# EAGLE design gotoDUO emonDC v0.3a (EAGLE 7.7.0)
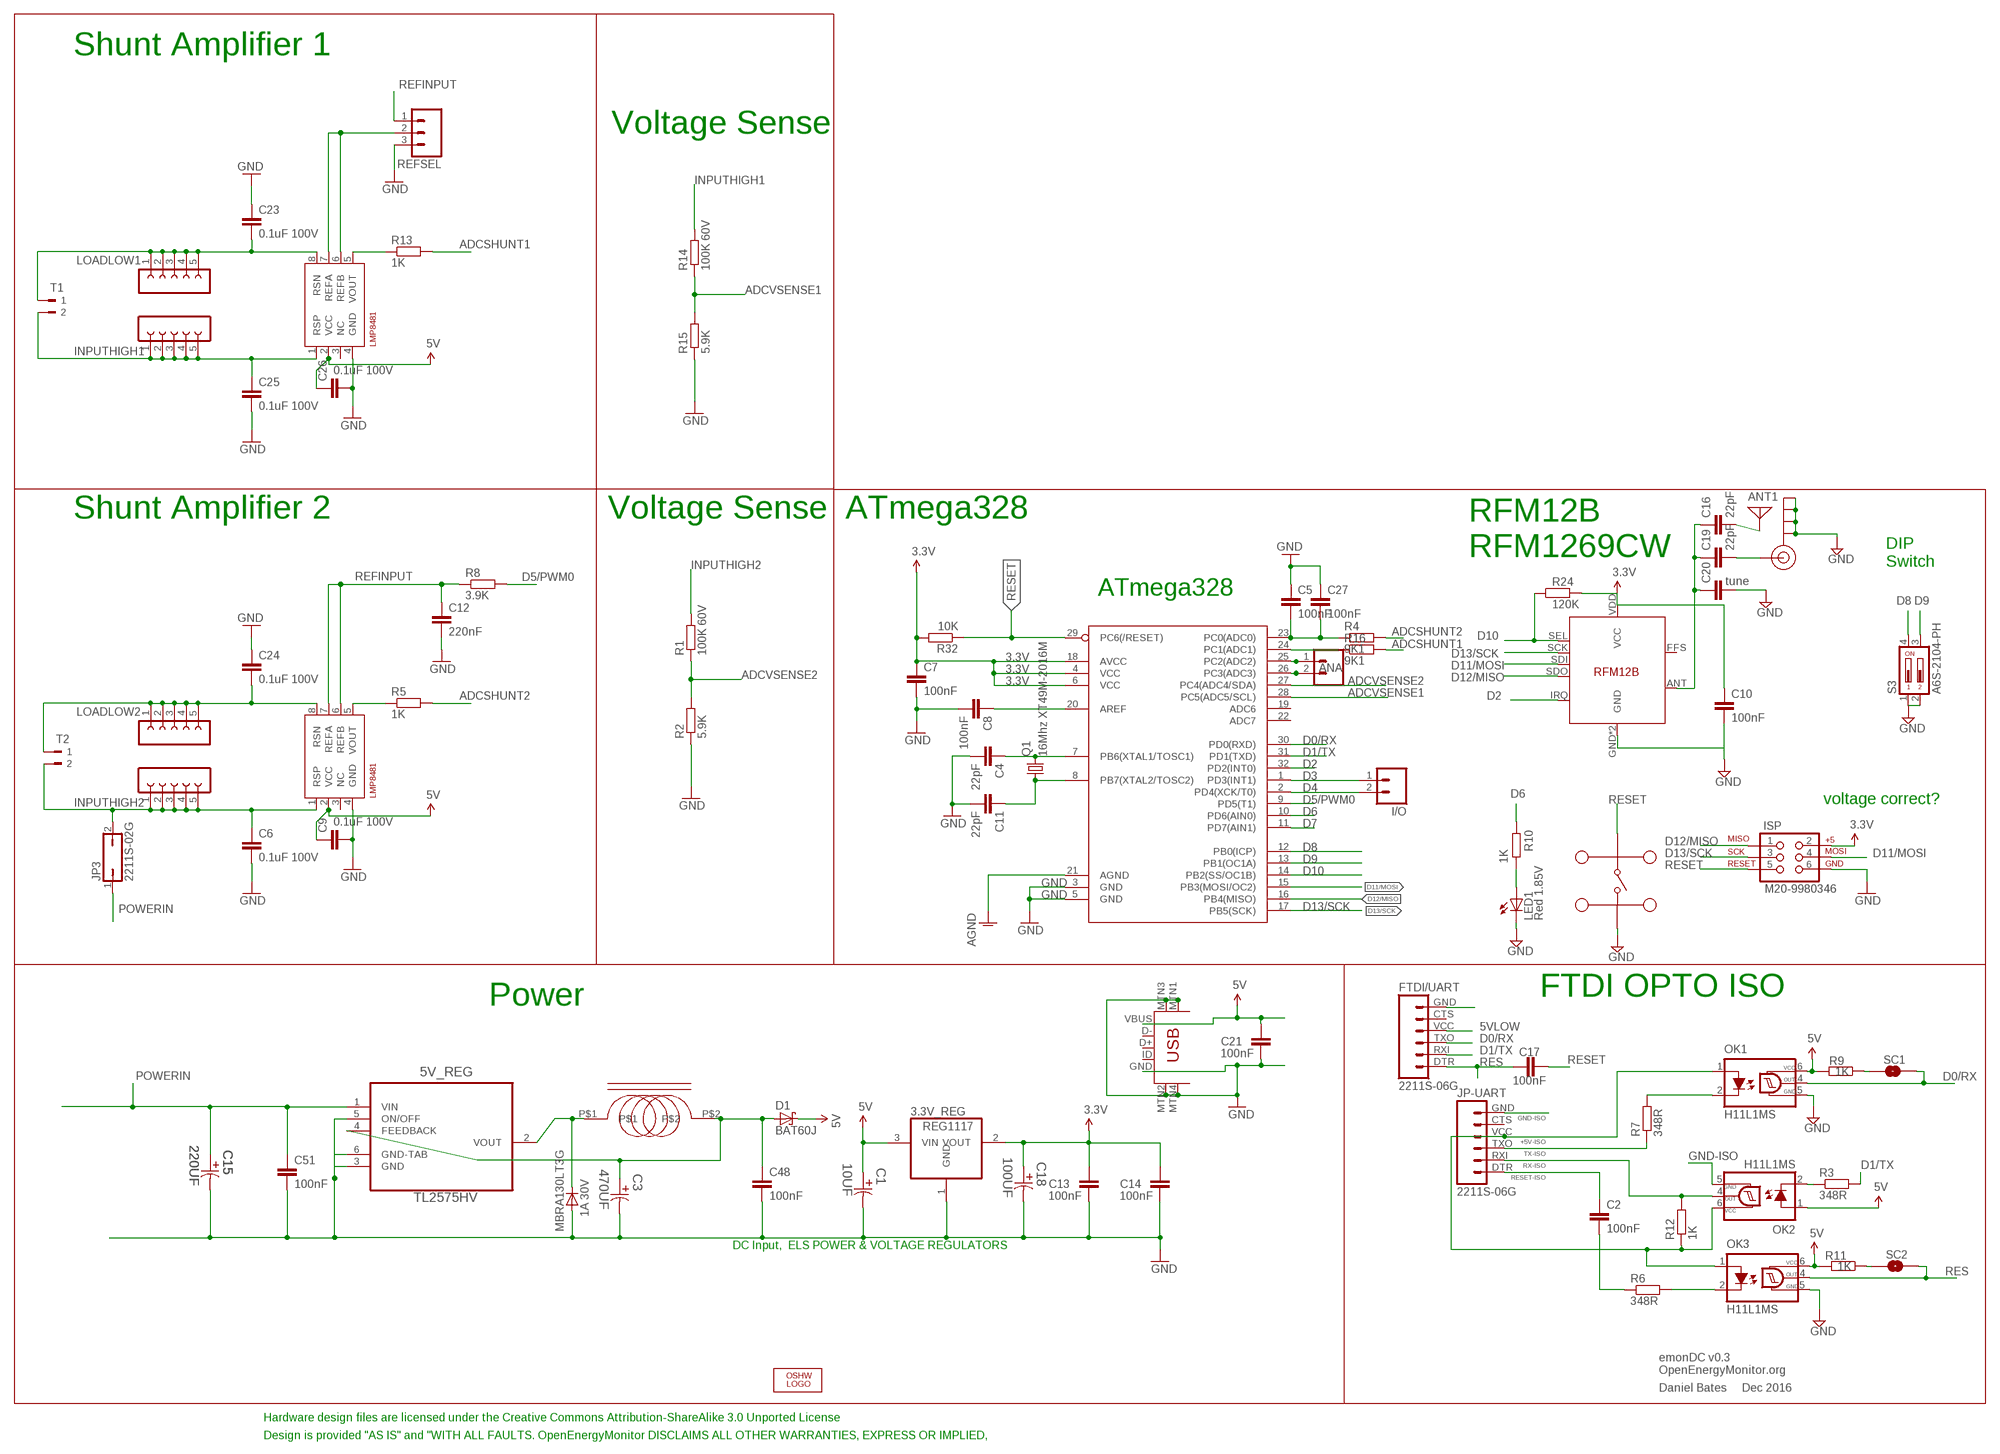
[diagram p0: schematic, sheet 1]

## Parts
3.3V_REG  REG1117  [SOT223]
5V_REG  TL2575HV  TL2575HV-05IKTTR  [TO-263]
ANA  2212S-02SG-85  M02LOCK  [1X02_LOCK]
ANT1  ANTENNA  [PAD-01]
C1  10UF  EEE-FK1E100R-CASE-B  [CAPAE430X610N]
C2  100nF  C-EUC0603  [C0603]
C3  470UF  EEE-FK1C471P-CASE-F  [CAPAE830X1050N]
C4  22pF  C-EUC0603  [C0603]
C5  100nF  C-EUC0603  [C0603]
C6  0.1uF 100V  C-EUC0603  [C0603]
C7  100nF  C-EUC0603  [C0603]
C8  100nF  C-EUC0603  [C0603]
C9  0.1uF 100V  C-EUC0603  [C0603]
C10  100nF  C-EUC0603  [C0603]
C11  22pF  C-EUC0603  [C0603]
C12  220nF  C-EUC0603  [C0603]
C13  100nF  C-EUC0603  [C0603]
C14  100nF  C-EUC0603  [C0603]
C15  220UF  EEV-FK1J221Q-CASE-H13  [CAPAE1350X1400N]
C16  22pF  C-EUC0603  [C0603]
C17  100nF  C-EUC0603  [C0603]
C18  100UF  EEE-FT0J101AR-CASE-B  [CAPAE430X610N]
C19  22pF  C-EUC0603  [C0603]
C20  tune  C-EUC0603  [C0603]
C21  100nF  C-EUC0603  [C0603]
C23  0.1uF 100V  C-EUC0603  [C0603]
C24  0.1uF 100V  C-EUC0603  [C0603]
C25  0.1uF 100V  C-EUC0603  [C0603]
C26  0.1uF 100V  C-EUC0603  [C0603]
C27  100nF  C-EUC0603  [C0603]
C48  100nF  C-EUC0603  [C0603]
C51  100nF  C-EUC0603  [C0603]
D1  BAT60J  [SOD323_ST]
D2  MBRA130LT3G  [DO-214]
FTDI/UART  2211S-06G  FTDI_BASICPTH  [FTDI_BASIC]
I1  SRR0603-331KL  [SRR0603-331KL]
I/O  2212S-02SG-85  M02LOCK  [1X02_LOCK]
ISP  M20-9980346  AVR_SPI_PRG_6PTH  [2X3]
J$1  SMA_EDGE  [SMA-EDGE]
JP3  2211S-02G  JP1Q  [JP1]
JP-LOAD  2212S-06SG-85  FE05-1  [FE05-1]
JP-LOAD1  2212S-06SG-85  FE05-1  [FE05-1]
JP-SOURCE  2212S-06SG-85  FE05-1  [FE05-1]
JP-SOURCE1  2212S-06SG-85  FE05-1  [FE05-1]
JP-UART  2211S-06G  FTDI_BASICPTH  [FTDI_BASIC]
LED1  Red 1.85V  LEDCHIP-LED0805  [CHIP-LED0805]
LMP1  LMP8481LMP8481-H  [S-PDSO-G08]
LMP8481  LMP8481-H  LMP8481LMP8481-H  [S-PDSO-G08]
LOGO1  OSHW_LOGO_6MILX0200-NT  [OSHW_6X200_NOTEXT]
MC32882  MC32882  [SWITCH_TACT_MULTICOMP]
OK1  H11L1MS  [DIL6-SMD]
OK2  H11L1MS  [DIL6-SMD]
OK3  H11L1MS  [DIL6-SMD]
Q1  16Mhz XT49M-2016M  CRYSTALHC49UP  [HC49UP]
R1  100K 60V  R-EU_R0603  [R0603]
R2  5.9K  R-EU_R0603  [R0603]
R3  348R  R-EU_R0603  [R0603]
R4  9K1  R-EU_R0603  [R0603]
R5  1K  R-EU_R0603  [R0603]
R6  348R  R-EU_R0603  [R0603]
R7  348R  R-EU_R0603  [R0603]
R8  3.9K  R-EU_R0603  [R0603]
R9  1K  R-EU_R0603  [R0603]
R10  1K  R-EU_R0603  [R0603]
R11  1K  R-EU_R0603  [R0603]
R12  1K  R-EU_R0603  [R0603]
R13  1K  R-EU_R0603  [R0603]
R14  100K 60V  R-EU_R0603  [R0603]
R15  5.9K  R-EU_R0603  [R0603]
R16  9K1  R-EU_R0603  [R0603]
R24  120K  R-EU_R0603  [R0603]
R32  10K  R-EU_R0603  [R0603]
REFSEL  2212S-02SG-85  CONN_03  [1X03]
RF  RFM12B  [RFM12B]
S3  A6S-2104-PH  2_SMT_DIP_SWITCH  [DIP_SWITCH_SMT]
SC1  SOLDERJUMPERNO  [SJ_2S-NO]
SC2  SOLDERJUMPERNO  [SJ_2S-NO]
T1  180-2  [180-2]
T2  180-2  [180-2]
U1_TQFP  ATMEGA328P  ATMEGA328_SMT  [TQFP32-08]
USB  MUSB-05-S-B-SM-A  USB-MINIB-5PIN  [USB-MINIB-CISECO]

## Nets
3.3V: 3.3V_REG.2(VOUT) C7.1 C10.1 C13.1 C14.1 C18.1 ISP.2 R24.2 R32.2 RF.VDD(VCC) U1_TQFP.4(VCC) U1_TQFP.6(VCC) U1_TQFP.18(AVCC)
5VHIGH [power]: 5V_REG.4(FEEDBACK) C3.1 C48.1 D1.A I1.P$2
5VLOW [power]: 3.3V_REG.3(VIN) C1.1 C9.1 C21.1 C26.1 D1.C FTDI/UART.VCC LMP1.2(VCC) LMP8481.2(VCC) OK1.6(VCC) OK2.1(A) OK3.6(VCC) R9.2 R11.2 USB.VBUS ; supply symbol labelled 5V
+5V-ISO [power]: JP-UART.VCC OK1.1(A) OK2.6(VCC) OK3.1(A) R12.1
ADCSHUNT1: R13.2 R16.2
ADCSHUNT2: R4.2 R5.2
ADCVSENSE1: R14.1 R15.2 U1_TQFP.28(PC5(ADC5/SCL))
ADCVSENSE2: R1.1 R2.2 U1_TQFP.27(PC4(ADC4/SDA))
AGND [thin_power]: U1_TQFP.21(AGND)
D0/RX: FTDI/UART.TXO OK1.4(OUT) SC1.1 U1_TQFP.30(PD0(RXD))
D1/TX: FTDI/UART.RXI R3.2 U1_TQFP.31(PD1(TXD))
D2: RF.IRQ U1_TQFP.32(PD2(INT0))
D3: I/O.1 U1_TQFP.1(PD3(INT1))
D4: I/O.2 U1_TQFP.2(PD4(XCK/T0))
D5/PWM0: R8.2 U1_TQFP.9(PD5(T1))
D6: R10.2 U1_TQFP.10(PD6(AIN0))
D7: U1_TQFP.11(PD7(AIN1))
D8: S3.4 U1_TQFP.12(PB0(ICP))
D9: S3.3 U1_TQFP.13(PB1(OC1A))
D10: R24.1 RF.SEL U1_TQFP.14(PB2(SS/OC1B))
D11/MOSI: ISP.4 RF.SDI U1_TQFP.15(PB3(MOSI/OC2))
D12/MISO: ISP.1 RF.SDO U1_TQFP.16(PB4(MISO))
D13/SCK: ISP.3 RF.SCK U1_TQFP.17(PB5(SCK))
DIG1: C16.1 C19.1 C20.1 RF.ANT
GND [thin_power]: 3.3V_REG.1(GND) 5V_REG.3(GND) 5V_REG.5(ON/OFF) 5V_REG.6(GND-TAB) C1.2 C3.2 C4.2 C5.1 C6.2 C7.2 C8.2 C9.2 C10.2 C11.2 C12.2 C13.2 C14.2 C15.2 C18.2 C20.2 C21.2 C23.1 C24.1 C25.2 C26.2 C27.1 C48.2 C51.2 D2.P$2(A) FTDI/UART.GND ISP.6 J$1.GND@0(GND) J$1.GND@1(GND) J$1.GND@2(GND) J$1.GND@3(GND) LED1.C LMP1.4(GND) LMP8481.4(GND) MC32882.P$3 MC32882.P$4 OK1.5(GND) OK3.5(GND) R2.1 R15.1 REFSEL.3 RF.GND RF.P$12(GND) S3.1 S3.2 U1_TQFP.3(GND) U1_TQFP.5(GND) USB.GND USB.MTN1(MTN2) USB.MTN2(MTN3) USB.MTN3(MTN1) USB.MTN4
GND-ISO [thin_power]: JP-UART.GND OK2.5(GND)
IND: 5V_REG.2(VOUT) D2.P$1(C) I1.P$1
INPUTHIGH1: C25.1 JP-LOAD1.1 JP-LOAD1.2 JP-LOAD1.3 JP-LOAD1.4 JP-LOAD1.5 LMP1.1(RSP) R14.2 T1.2
INPUTHIGH2: C6.1 JP3.2 JP-LOAD.1 JP-LOAD.2 JP-LOAD.3 JP-LOAD.4 JP-LOAD.5 LMP8481.1(RSP) R1.2 T2.2
LOADLOW1: C23.2 JP-SOURCE1.1 JP-SOURCE1.2 JP-SOURCE1.3 JP-SOURCE1.4 JP-SOURCE1.5 LMP1.8(RSN) T1.1
LOADLOW2: C24.2 JP-SOURCE.1 JP-SOURCE.2 JP-SOURCE.3 JP-SOURCE.4 JP-SOURCE.5 LMP8481.8(RSN) T2.1
N$1: C4.1 Q1.2 U1_TQFP.7(PB6(XTAL1/TOSC1))
N$2: C5.2 C27.2 R4.1 U1_TQFP.23(PC0(ADC0))
N$3: R11.1 SC2.2
N$4: LMP1.5(VOUT) R13.1
N$5: R9.1 SC1.2
N$6: LMP8481.5(VOUT) R5.1
N$9: C11.1 Q1.1 U1_TQFP.8(PB7(XTAL2/TOSC2))
N$10: C2.1 JP-UART.DTR
N$11: ANT1.1 C16.2
N$13: OK1.2(C) R7.2
N$15: OK2.2(C) R3.1
N$17: OK3.2(C) R6.2
N$20: C8.1 U1_TQFP.20(AREF)
N$22: ANA.2 U1_TQFP.26(PC3(ADC3))
N$23: ANA.1 U1_TQFP.25(PC2(ADC2))
N$24: C19.2 J$1.SIG(SIGNAL)
N$27: R16.1 U1_TQFP.24(PC1(ADC1))
N$28 [thin_power]: LMP1.6(REFB) LMP1.7(REFA) REFSEL.2
N$41: LED1.A R10.1
POWERIN: 5V_REG.1(VIN) C15.1 C51.1 JP3.1
REFINPUT: C12.1 LMP8481.6(REFB) LMP8481.7(REFA) R8.1 REFSEL.1
RES: C17.1 FTDI/UART.DTR OK3.4(OUT) SC2.1
RESET: C17.2 ISP.5 MC32882.P$1 MC32882.P$2 R32.1 U1_TQFP.29(PC6(/RESET))
RESET-ISO: C2.2 R6.1
RX-ISO: JP-UART.RXI OK2.4(OUT) R12.2
TX-ISO: JP-UART.TXO R7.1
Unconnected: FTDI/UART.CTS JP-UART.CTS LMP1.3(NC) LMP8481.3(NC) RF.FFS U1_TQFP.19(ADC6) U1_TQFP.22(ADC7) USB.D+ USB.D- USB.ID

## Notes on the sheet
- Shunt Amplifier 1
- Voltage Sense
- Shunt Amplifier 2 | Voltage Sense | ATmega328
- RFM12B
  RFM1269CW
- DIP
  Switch
- ATmega328
- voltage correct?
- Power | FTDI OPTO ISO
- DC Input,  ELS POWER & VOLTAGE REGULATORS
- emonDC v0.3
  OpenEnergyMonitor.org
- Daniel Bates     Dec 2016
- Hardware design files are licensed under the Creative Commons Attribution-ShareAlike 3.0 Unported License
- Design is provided "AS IS" and "WITH ALL FAULTS. OpenEnergyMonitor DISCLAIMS ALL OTHER WARRANTIES, EXPRESS OR IMPLIED,

## Library data of the parts
3.3V_REG = burr-brown:REG1117: 800mA and 1A Low Dropout (LDO) Positive Regulator 1.8V, 2.5V, 2.85V, 3.3V, 5V, and Adj; MF: TEXAS INSTRUMENTS; MPN: REG1117; OC_FARNELL: 1097566; OC_NEWARK: 14P6981
5V_REG = TL2575HV:TL2575HV; MF: TEXAS INSTRUMENTS; MPN: LM2575HVS-15/NOPB; OC_FARNELL: 2492609
ANA I/O = SparkFun-Connectors:M02: Standard 2-pin 0.1" header. Use with - straight break away headers ( PRT-00116) - right angle break away headers (PRT-00553) - swiss pins (PRT-00743) - machine pins (PRT-00117) - female headers (PRT-00115) Molex polarized connector foot print use with: PRT-08233 with associated crimp pins and housings. 2.54_SCREWTERM for use with PRT-10571. 3.5mm Screw Terminal footprints for PRT-08084 5mm Screw Terminal footprints for use with PRT-08432; MF: MULTICOMP; MPN: 2212S-02SG-85; OC_FARNELL: 1593458
ANT1 = discrete:ANTENNA: Antenna; OC_FARNELL: unknown
C1 = Panasonic-EEEFK_EEEFP:EEE-: Aluminum Electrolytic Capacitors,Surface Mount Type; MPN: EEE-FK1E100R; OC_FARNELL: 9695729; OC_NEWARK: 96K9386; PACKAGE: CASE-B; SUPPLIER: PANASONIC; TOLERANCE: ±20 %; VOLTAGERATING: 25V
C2 C4 C5 C7 C8 C10-C14 C16 C17 C19-C21 C27 C48 C51 = rcl:C-EU: CAPACITOR, European symbol
C3 = Panasonic-EEEFK_EEEFP:EEE-: Aluminum Electrolytic Capacitors,Surface Mount Type; MPN: EEE-FK1C471P; OC_FARNELL: 9695710; OC_NEWARK: 96K9385; PACKAGE: CASE-F; SUPPLIER: PANASONIC; TOLERANCE: ±20 %; VOLTAGERATING: 16V
C6 C9 C23-C26 = rcl:C-EU: CAPACITOR, European symbol; MPN: C1608X7S2A104K080AB
C15 = Panasonic-EEE-EEV-EEF-ECQ:EEV-: Aluminum Electrolytic Capacitors,Surface Mount Type; MPN: EEVFK1J221Q; OC_FARNELL: 9696059; OC_NEWARK: 96K9481; SUPPLIER: PANASONIC; TOLERANCE: ±20 %; VOLTAGERATING: 63V
C18 = Panasonic-EEEFT_EEEH:EEE-: Aluminum Electrolytic Capacitors,Surface Mount Type; MPN: EEE-FT0J101AR; OC_FARNELL: 2065951; OC_NEWARK: 73T9146; PACKAGE: CASE-B; SUPPLIER: PANASONIC; TOLERANCE: ±20 %; VOLTAGERATING: 6.3V
D1 = diode:BAT60J: Schottky barrier diode Source: www.st.com, BAT60J.pdf
D2 = CASE 403D Diode:MBRA130LT3G: Fast switching diode; MF: ON SEMICONDUCTOR; MPN: MBRA130LT3G; OC_FARNELL: 9555978
FTDI/UART JP-UART = SparkFun:FTDI_BASIC: FTDI Basic: 3.3V and 5V; MF: MULTICOMP; MPN: 2211S-06G; OC_FARNELL: 1593415
I1 = SRR0603-331KL:SRR0603-331KL: SRR0603-331KL; INDUCTANCE: 330uH; MF: BOURNS; MPN: SRR0603-331KL; OC_FARNELL: 2333890
ISP = SparkFun:AVR_SPI_PRG_6: AVR ISP 6 Pin This is the reduced ISP connector for AVR programming. Common on Arduino. This footprint will take up less PCB space and can be used with a 10-pin to 6-pin adapter such as SKU: BOB-08508; MF: HARWIN; MPN: M20-9980346; OC_FARNELL: 1022231
J$1 = SparkFun-Connectors:SMA_EDGE: SMA Antenna Connector End launch SMA connector. The paste layer has been removed so that the connector can be hand soldered onto the board after reflow.; OC_FARNELL: unknown
JP3 = jumper:JP1Q: JUMPER; MF: MULTICOMP; MPN: 2211S-02G; OC_FARNELL: 1593411
JP-LOAD JP-LOAD1 JP-SOURCE JP-SOURCE1 = con-lsta:FE05-1: FEMALE HEADER; MF: MULTICOMP; MPN: 2212S-06SG-85; OC_FARNELL: 1593462; OC_NEWARK: unknown
LED1 = adafruit:LED: LED OSRAM: - CHIPLED LG R971, LG N971, LY N971, LG Q971, LY Q971, LO R971, LY R971 LH N974, LH R974 LS Q976, LO Q976, LY Q976 LO Q996 - Hyper CHIPLED LW Q18S LB Q993, LB Q99A, LB R99A - SideLED LS A670, LO A670, LY A670, LG A670, LP A670 LB A673, LV A673, LT A673, LW A673 LH A674 LY A675 LS A676, LA A676, LO A676, LY A676, LW A676 LS A679, LY A679, LG A679 - Hyper Micro SIDELED® LS Y876, LA Y876, LO Y876, LY Y876 LT Y87S - SmartLED LW L88C, LW L88S LB L89C, LB L89S, LG L890 LS L89K, LO L89K, LY L89K LS L896, LA L896, LO L896, LY L896 - TOPLED LS T670, LO T670, LY T670, LG T670, LP T670 LSG T670, LSP T670, LSY T670, LOP T670, LYG T670 LG T671, LOG T671, LSG T671 LB T673, LV T673, LT T673, LW T673 LH T674 LS T676, LA T676, LO T676, LY T676, LB T676, LH T676, LSB T676, LW T676 LB T67C, LV T67C, LT T67C, LS T67K, LO T67K, LY T67K, LW E67C LS E67B, LA E67B, LO E67B, LY E67B, LB E67C, LV E67C, LT E67C LW T67C LS T679, LY T679, LG T679 LS T770, LO T770, LY T770, LG T770, LP T770 LB T773, LV T773, LT T773, LW T773 LH T774 LS E675, LA E675, LY E675, LS T675 LS T776, LA T776, LO T776, LY T776, LB T776 LHGB T686 LT T68C, LB T68C - Hyper Mini TOPLED® LB M676 - Mini TOPLED Santana® LG M470 LS M47K, LO M47K, LY M47K Source: http://www.osram.convergy.de/; MF: ROHM; MPN: SML-211UTT86K; OC_FARNELL: 1685056
LMP1 = libsexportlmp8481b:LMP8481: LMP8481MM-H/NOPB 100V/V; MF: TEXAS INSTRUMENTS; MPN: LMP8481MME-S/NOPB; OC_FARNELL: 2322044
LMP8481 = libsexportlmp8481b:LMP8481: LMP8481MM-H/NOPB 100V/V; MF: TEXAS INSTRUMENTS; MPN: LMP8481MME-H/NOPB; OC_FARNELL: 2322044
LOGO1 = ohw-logo:OSHW_LOGO_6MIL; OC_FARNELL: unknown
MC32882 = multicomp tact switch:MC32882
OK1-OK3 = optocoupler:H11L*M: 6-Pin DIP Optocoupler Source: http://www.fairchildsemi.com/ds/H1/H11L2-M.pdf; OC_FARNELL: unknown; OC_NEWARK: unknown
Q1 = adafruit:CRYSTAL: CRYSTAL; MF: VISHAY; MPN: XT49M-2016M; OC_FARNELL: 1469641; OC_NEWARK: unknown
R1 R14 = rcl:R-EU_: RESISTOR, European symbol; MPN: MCWR06X1003FTL
R2 R15 = rcl:R-EU_: RESISTOR, European symbol; MPN: MCWR06X5901FTL
R3-R13 R16 R24 R32 = rcl:R-EU_: RESISTOR, European symbol
REFSEL = SparkFun-Connectors:CONN_03: Multi connection point. Often used as Generic Header-pin footprint for 0.1 inch spaced/style header connections On any of the 0.1 inch spaced packages, you can populate with these: Break Away Headers - Straight <https://www.sparkfun.com/products/116> (PRT-00116) Break Away Male Headers - Right Angle <https://www.sparkfun.com/products/553> (PRT-00553) Female Headers <https://www.sparkfun.com/products/115> (PRT-00115) Break Away Headers - Machine Pin <https://www.sparkfun.com/products/117> (PRT-00117) Break Away Female Headers - Swiss Machine Pin <https://www.sparkfun.com/products/743> (PRT-00743) Stackable Header - 3 Pin (Female, 0.1") <https://www.sparkfun.com/products/13875> (PRT-13875) For SCREWTERMINALS and SPRING TERMINALS visit here: Screw Terimnals on SparkFun.com <https://www.sparkfun.com/search/results?term=Screw+Terminals> (5mm/3.5mm/2.54mm spacing) This device is also useful as a general connection point to wire up your design to another part of your project. Our various solder wires solder well into these plated through hole pads. Hook-Up Wire - Assortment (Stranded, 22 AWG) <https://www.sparkfun.com/products/11375> (PRT-11375) Hook-Up Wire - Assortment (Solid Core, 22 AWG) <https://www.sparkfun.com/products/11367> (PRT-11367) View the entire wire category on our website here <https://www.sparkfun.com/categories/141> Special notes: Molex polarized connector foot print use with SKU : PRT-08232 with associated crimp pins and housings.; MF: MULTICOMP; MPN: 2212S-02SG-85; OC_FARNELL: 1593458
RF = JeeParts:RFM12B; OC_FARNELL: unknown
S3 = OpenEnergyMonitor:2_SMT_DIP_SWITCH: Multicomp MCEMR-02-T 2 throw SMT DIP switch, Farnell 1524005; MF: OMRON ELECTRONIC COMPONENTS; MPN: A6S2104H; OC_FARNELL: 1960894
SC1 SC2 = SparkFun:SOLDERJUMPER: Solder Jumper Standard SMD solder jumper. Used to automate production. Two varients : Normally Open and Normally Closed are the same, but have different paste layers. NC will have a large amount of paste and should jumper during reflow.
T1 T2 = con-weidmueller-sl35:180-2: WEIDMUELLER CLAMP CONNECTOR; OC_FARNELL: unknown; OC_NEWARK: unknown
U1_TQFP = SparkFun-DigitalIC:ATMEGA328_SMT: 32-Pin Atmega328 part Commonly used on Arduino compatible boards Available in QFP and QFN packages TQFP is IC-09069 QFN is non-stock; MF: ATMEL; MPN: ATMEGA328-AU; OC_FARNELL: 1972086; PROD_ID: IC-09069
USB = Ciseco USB miniB:USB-MINIB: Mini-USB "B" connector with 5th pin broken out. Created new symbol breaking out 5th "ID" pin in mini/micro USB connector spec. See: http://en.wikipedia.org/wiki/Mini_usb#Cables. Uses same footprint as 4-pin symbol. Also added pins to connect to mounting / shield pads if required (probably not generally needed as signals aren't shielded once they leave the connector). Modified by Ciseco for Rapid Part 24-0357; MF: MOLEX; MPN: 67503-1020; OC_FARNELL: 1125348

## Net classes
2 thin_power: width 0.254 mm

## Board
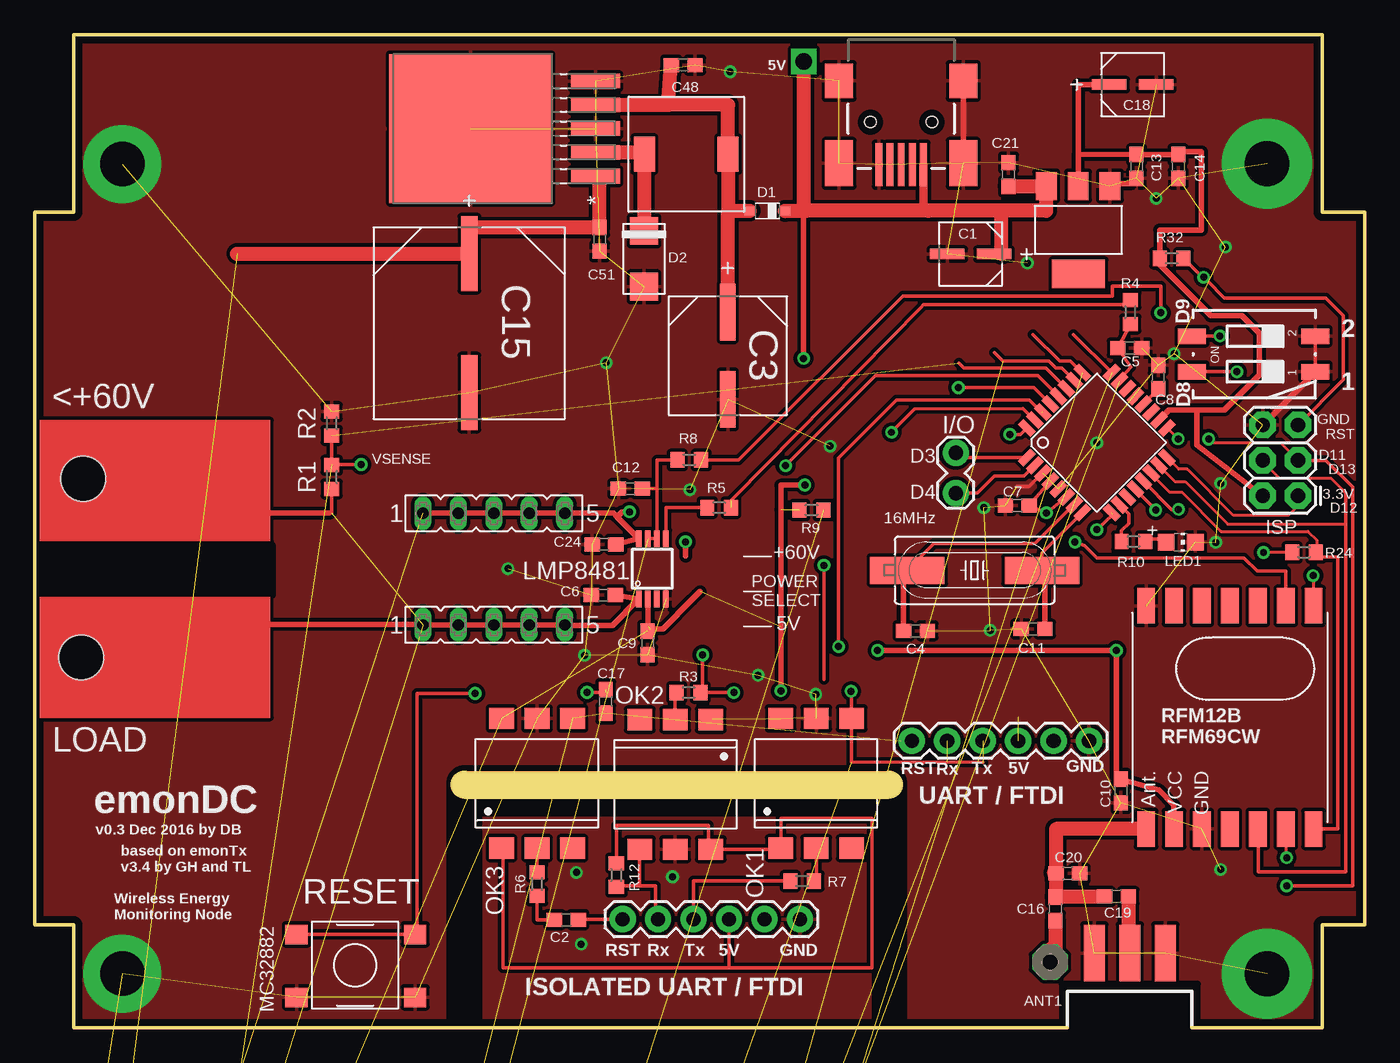
[diagram p1: board, top side]
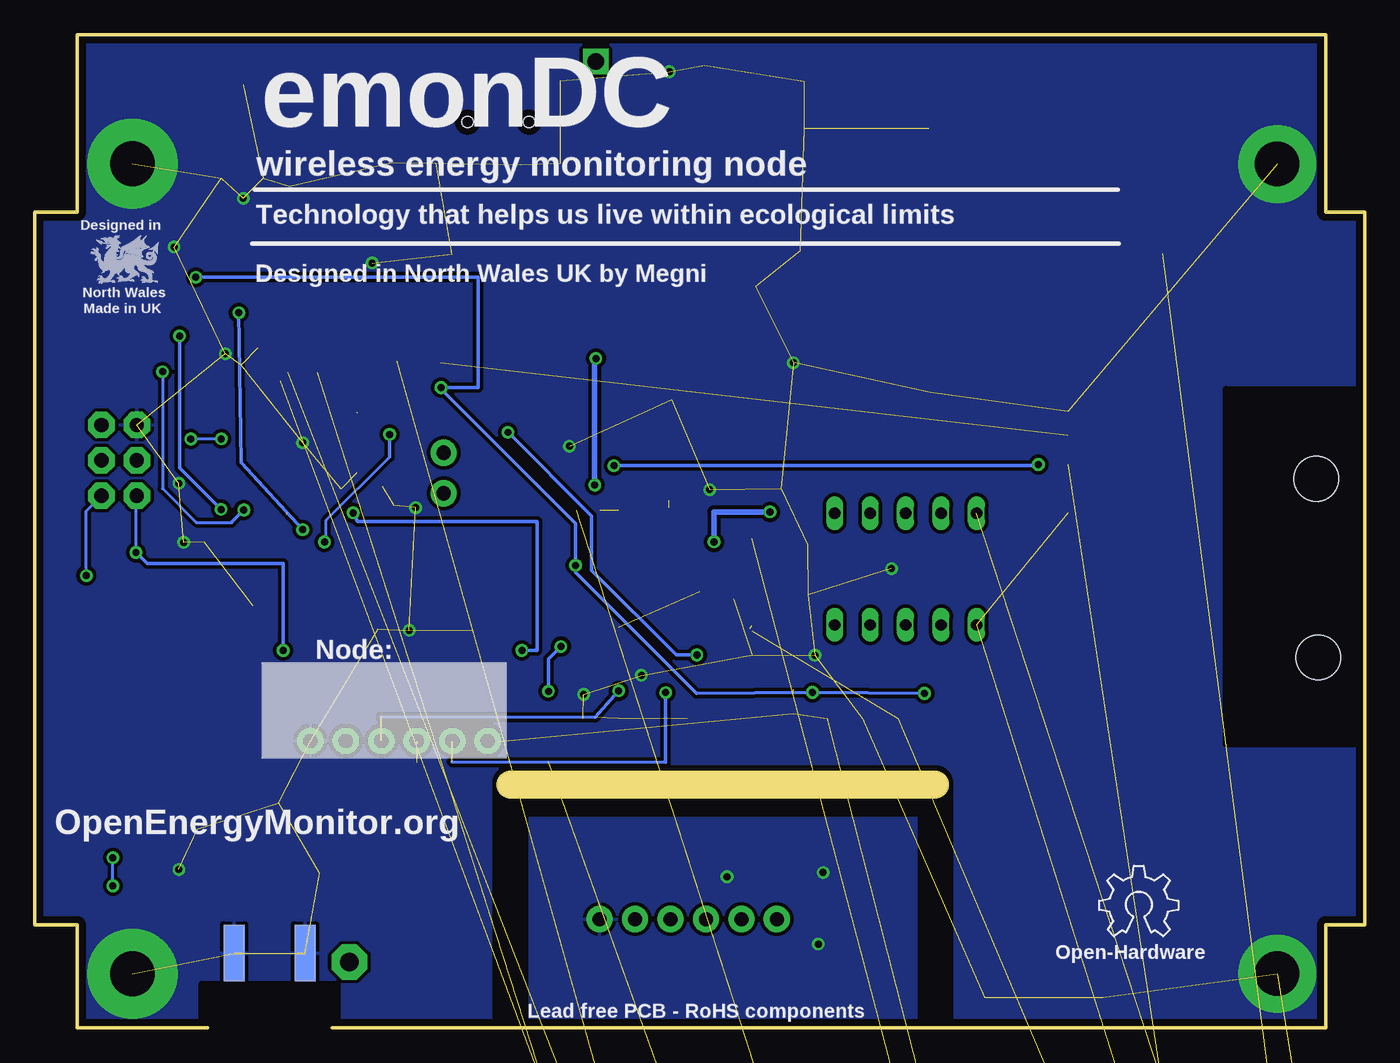
[diagram p2: board, bottom side, seen from below]

Size 95.25 x 71.12 mm. Coordinates in mm from the lower left corner, seen from the top.
Outline: 2.79,0 2.79,7.37 0,7.37 0,58.42 2.79,58.42 2.79,71.12 92.2,71.12 92.2,58.42 95.25,58.42 95.25,7.37 92.2,7.37 92.2,0
Outline: 92.21,0 82.87,0
Outline: 73.97,0 2.79,0
Copper layers (1*16): Top 0.0178mm / dielectric 59mil / Bottom 0.0178mm
Design rules "SSC-EAGLE-2Lyr_v1.0.0.3": minimum track width 6mil, minimum drill 14mil, track to track 6mil, track to pad 6mil, pad to pad 6mil, via to via 6mil, smd to smd 6mil, copper to edge 20mil, drill to drill 16mil, minimum pad ring 8mil, minimum via ring 8mil, stop-mask expansion 3mil, vias tented up to drill 0mil, thermal gap 10mil
Holes 3.2 mm at 3.45,39.32 3.33,26.52
tRestrict: area 0.3,31 to 17,34.5; area 73.6,0.3 to 83.3,3.1; 3 lines
bRestrict: area 0.3,34.8 to 7.1,43.4; area 0.3,22.4 to 7.1,30.7; area 0.3,20.3 to 9.9,45.7; area 73.6,0.3 to 83.3,3.1; 3 lines
Milling: 1 lines

### Footprints (pad centres in the part's own frame; a part is rotated, then mirrored left to right if it is on the bottom)
SOT223 = smd 1.499 x 2.007: 1 -2.261,-3.15; 2 0.025,-3.15; 3 2.311,-3.15 | smd 3.81 x 2.007: 4 0,3.15
TO-263 = smd 1.041 x 3.505: 1 -3.404,-8.788; 2 -1.702,-8.788; 3 0,-8.788; 4 1.702,-8.788; 5 3.404,-8.788 | smd 10.668 x 11.659: 6 0,0.152
1X02_LOCK = drill 1.016 pad 1.88: 1 -0.178,0; 2 2.718,0
PAD-01 = drill 1.321 pad 2.54 octagon: 1 0,0
CAPAE430X610N = smd 2.464 x 0.762: 1 -1.676,0; 2 1.676,0
C0603 = smd 1.1 x 1: 1 -0.85,0; 2 0.85,0
CAPAE830X1050N = smd 4.064 x 1.092: 1 -3.124,0; 2 3.124,0
CAPAE1350X1400N = smd 5.359 x 1.194: 1 -4.978,0; 2 4.978,0
SOD323_ST = smd 0.8 x 0.6: A 1.25,0; C -1.25,0
DO-214 = smd 2 x 2: P$1 -2,0; P$2 2,0
FTDI_BASIC = drill 1.016 pad 1.88: CTS 10.16,0; DTR 0,0; GND 12.7,0; RXI 2.54,0; TXO 5.08,0; VCC 7.62,0
SRR0603-331KL = smd 1.5 x 2.5: P$1 -3,0; P$2 3,0
2X3 = drill 1.016 pad 1.88 octagon: 1 0,0; 2 0,2.54; 3 2.54,0; 4 2.54,2.54; 5 5.08,0; 6 5.08,2.54
SMA-EDGE = smd 1.524 x 4.064: GND@0 0,0; GND@1 5.08,0; SIG 2.54,0 | smd 1.524 x 4.064 bottom: GND@2 0,0; GND@3 5.08,0
JP1 = drill 0.914 long: 1 0,-1.27; 2 0,1.27
FE05-1 = drill 0.813 long: 1 -5.08,0; 2 -2.54,0; 3 0,0; 4 2.54,0; 5 5.08,0
CHIP-LED0805 = smd 1.2 x 1.2: A 0,-1.05; C 0,1.05
S-PDSO-G08 = smd 0.4 x 1.2: 1 -0.975,-2.157; 2 -0.325,-2.157; 3 0.325,-2.157; 4 0.975,-2.157; 5 0.975,2.157; 6 0.325,2.157; 7 -0.325,2.157; 8 -0.975,2.157
SWITCH_TACT_MULTICOMP = smd 1.6 x 1.4: P$1 -1.1,5.3; P$2 7.4,5.3; P$3 -1.1,0.8; P$4 7.4,0.8
DIL6-SMD = smd 1.78 x 1.52: 1 -2.54,-4.645; 2 0,-4.645; 3 2.54,-4.645; 4 2.54,4.645; 5 0,4.645; 6 -2.54,4.645
HC49UP = smd 5.334 x 1.93: 1 -4.826,0; 2 4.826,0
R0603 = smd 1 x 1.1: 1 -0.85,0; 2 0.85,0
1X03 = drill 1.016 pad 1.88: 1 0,0; 2 2.54,0; 3 5.08,0
RFM12B = smd 2.54 x 1.27: ANT 8,-6; FFS -8,2; GND 8,-2; IRQ -8,4; P$8 -8,0; P$9 -8,-2; P$10 -8,-4; P$12 -8,-6; P$16 8,0; SCK 8,4; SDI 8,2; SDO -8,6; SEL 8,6; VDD 8,-4
DIP_SWITCH_SMT = smd 1.1 x 2: 1 -1.27,-4.215; 2 1.27,-4.215; 3 1.27,4.615; 4 -1.27,4.615
SJ_2S-NO = smd 0.635 x 1.27: 1 -0.45,0; 2 0.45,0
180-2 = drill 1.422 long: 1 -1.75,0; 2 1.75,0
TQFP32-08 = smd 1.27 x 0.559: 1 -4.293,2.8; 2 -4.293,2; 3 -4.293,1.2; 4 -4.293,0.4; 5 -4.293,-0.4; 6 -4.293,-1.2; 7 -4.293,-2; 8 -4.293,-2.8; 17 4.293,-2.8; 18 4.293,-2; 19 4.293,-1.2; 20 4.293,-0.4; 21 4.293,0.4; 22 4.293,1.2; 23 4.293,2; 24 4.293,2.8 | smd 0.559 x 1.27: 9 -2.8,-4.293; 10 -2,-4.293; 11 -1.2,-4.293; 12 -0.4,-4.293; 13 0.4,-4.293; 14 1.2,-4.293; 15 2,-4.293; 16 2.8,-4.293; 25 2.8,4.293; 26 2,4.293; 27 1.2,4.293; 28 0.4,4.293; 29 -0.4,4.293; 30 -1.2,4.293; 31 -2,4.293; 32 -2.8,4.293
USB-MINIB-CISECO = smd 3.1 x 0.5: D+ 8.25,0; D- 8.25,0.8; GND 8.25,-1.6; ID 8.25,-0.8; VBUS 8.25,1.6 | smd 2.5 x 2: MTN1 2.25,4.45; MTN3 2.25,-4.45 | smd 3.3 x 2: MTN2 8.15,4.45; MTN4 8.15,-4.45 | hole 0.8: 5.2,2.2; 5.2,-2.2

### Placement (x,y rotation side)
3.3V_REG  74.76,57.15 180 top
5V_REG  31.36,64.4 90 top
ANA  -1.52,-194.31 0 top  (outside the outline)
ANT1  72.72,4.7 0 top
C1  67.03,55.42 180 top
C2  38.07,7.73 180 top
C3  49.63,48.13 270 top
C4  63.08,28.42 0 top
C5  78.43,48.7 180 top
C6  40.72,30.99 180 top
C7  70.37,37.4 180 top
C8  80.47,46.61 90 top
C9  43.89,27.56 270 top
C10  77.8,16.95 270 top
C11  71.5,28.56 180 top
C12  42.65,38.61 180 top
C13  78.91,61.7 270 top
C14  81.89,61.7 270 top
C15  31.11,50.47 270 top
C16  73.1,8.51 270 top
C17  40.89,23.37 90 top
C18  78.64,67.56 0 top
C19  77.47,9.4 0 top
C20  73.99,11.05 0 top
C21  69.75,61.12 90 top
C23  16.76,-113.03 0 top  (outside the outline)
C24  40.77,34.62 0 top
C25  -8.38,-125.22 0 top  (outside the outline)
C26  3.56,-125.22 0 top  (outside the outline)
C27  -8.38,-182.37 0 top  (outside the outline)
C48  46.43,68.96 0 top
C51  40.45,56.48 270 top
D1  52.47,58.51 180 top
D2  43.63,55.08 270 top
FTDI/UART  62.81,20.55 0 top
I1  46.66,62.57 0 top
I/O  65.97,41 270 top
ISP  90.49,38.1 90 top
J$1  80.98,5.33 180 top
JP3  -18.03,-195.58 0 top  (outside the outline)
JP-LOAD  32.88,28.85 0 top
JP-LOAD1  0.25,-104.39 0 top  (outside the outline)
JP-SOURCE  32.88,36.85 0 top
JP-SOURCE1  0.25,-116.59 0 top  (outside the outline)
JP-UART  42.1,7.77 0 top
LED1  82.08,34.77 270 top
LMP1  -7.37,-72.64 0 top  (outside the outline)
LMP8481  44.23,32.87 0 top
LOGO1  19.02,6.53 0 bottom
MC32882  19.84,1.37 0 top
OK1  55.97,17.5 0 top
OK2  45.87,17.43 180 top
OK3  35.97,17.5 0 top
Q1  67.31,32.77 180 top
R1  21.26,39.45 270 top
R2  21.26,43.28 270 top
R3  46.82,24.01 0 top
R4  78.47,51.26 90 top
R5  49.01,37.26 0 top
R6  35.97,10.28 90 top
R7  54.97,10.5 0 top
R8  46.87,40.67 0 top
R9  55.63,37.08 180 top
R10  78.69,34.83 180 top
R11  -23.37,-215.39 0 top  (outside the outline)
R12  41.66,10.92 270 top
R13  27.18,-125.22 0 top  (outside the outline)
R14  -9.4,-167.89 0 top  (outside the outline)
R15  -9.4,-172.72 0 top  (outside the outline)
R16  -9.4,-177.55 0 top  (outside the outline)
R24  90.92,34.05 180 top
R32  81.42,55.11 180 top
REFSEL  -1.52,-137.16 0 top  (outside the outline)
RF  85.6,22.23 270 top
S3  87.5,48.26 90 top
SC1  -23.37,-210.82 0 top  (outside the outline)
SC2  -23.37,-219.96 0 top  (outside the outline)
T1  3.05,-22.86 0 top  (outside the outline)
T2  3.05,-44.2 0 top  (outside the outline)
U1_TQFP  76.07,41.91 45 top
USB  62.05,70.07 270 top

### Tracks (layer width: path | path; a pad name or v marks a point on that pad's centre or on a via)
3.3V  (via drill 0.5)  (1 unrouted)
  Top 0.203: R24.2 88.03,34.05 v88.01,34.04 | U1_TQFP.4 72.81,39.16 72.87,39.19 72.92,39.32 | 80.48,43.48 U1_TQFP.18 | 73.91,38 U1_TQFP.6
  Top 0.254: U1_TQFP.4 C7.1 v72.46,36.88 U1_TQFP.6 | R32.2 80.57,54.65 | 81.22,44.25 81.22,44.23 | v77.47,27.03 77.47,27
  Top 0.406: RF.VDD 81.6,15.94 80.52,17.02 C10.1 77.47,17.87 v77.47,27.03 v77.47,27.02 v60.37,27.02 | 73.89,38.07 U1_TQFP.6 | 80.57,54.65 84.22,51 86.47,51 87.72,49.75 87.72,46.75 85.22,44.25 83.22,44.25 | 83.22,44.25 81.22,44.25 | 81.22,44.23 U1_TQFP.18 | 3.3V_REG.2 74.73,62.57 | 74.73,62.57 C13.1 C14.1 81.97,62.75 83.56,62.75 83.57,57.15 80.57,57.15 R32.2 | 74.73,62.57 74.73,67.56 C18.1 | ISP.2 83.22,41.75 83.22,44.25
  Bottom 0.203: v88.01,34.04 88.01,38.04 ISP.2
  Bottom 0.254: v72.46,36.88 72.14,36.27 59.27,36.27 59.27,27.02 v60.37,27.02 | 87.99,34.04 87.2,33.25 77.47,33.25 v77.47,27.03
5VHIGH
  Top 1.016: 5V_REG.4 45.36,66.11 | 45.36,66.11 C48.1 | 45.36,66.11 49.66,66.11 I1.P$2 49.66,58.54 | 49.66,58.54 D1.A | 49.66,58.54 49.66,51.28 arc-90 C3.1
5VLOW  (via drill 0.5, 1.2)  (10 unrouted)
  Top 0.406: C1.1 69.24,55.42 | 53.78,58.53 55.06,58.53 v55.06,47.94 | v55.15,38.87 53.43,38.87 53.43,37.08 53.43,28.7 v53.43,24.13 | 48.41,22.14 OK2.1 | LMP8481.2 43.91,28.77 | C9.1 44.06,28.57 44.98,28.57 47.07,30.66 47.41,31 47.65,31.24
  Top 0.5: 48.53,22.13 OK2.1
  Top 0.61: USB.VBUS 63.65,58.85 arc90 63.98,58.53
  Top 1.016: 55.07,58.53 55.27,58.53 | v55.07,69.22 55.07,58.53 | 55.27,58.59 55.27,58.53 | D1.C arc90 53.78,58.53 55.07,58.53 | C21.1 69.78,60.3 3.3V_REG.3 72.44,58.53 69.24,58.53 | 69.24,58.53 63.98,58.53 55.27,58.53 | 69.24,55.42 69.24,58.53
  Bottom 0.254: 70.43,22.25 55.12,22.23 v53.43,24.13
  Bottom 0.406: v55.06,47.94 55.15,47.94 v55.15,38.87
+5V-ISO
  Top 0.254: JP-UART.VCC 49.72,4.27 | 49.72,4.27 33.53,4.27 33.53,12.8 OK3.1 | 49.72,4.27 59.94,4.27 59.94,14.99 53.43,14.99 OK1.1 53.45,12.79 OK2.6 48.26,12.78 48.26,14.48 41.66,14.48 R12.1
ADCSHUNT1  (1 unrouted)
ADCSHUNT2  (1 unrouted)
  Top 0.254: R4.2 78.37,52.11 78.05,51.79 63.66,51.79 63.47,51.6 50.12,38.02 49.86,37.76
ADCVSENSE1  (via drill 0.5)  (2 unrouted)
  Top 0.254: v53.77,40.26 60.22,46.71 71.84,46.71 U1_TQFP.28 | v23.37,40.34 21.26,40.34
  Bottom 0.254: v53.77,40.26 23.44,40.26 v23.37,40.34
ADCVSENSE2  (1 unrouted)
  Top 0.254: R2.2 R1.1 | U1_TQFP.27 72.44,47.24 66.55,47.24 66.19,47.6
D0/RX  (via drill 0.5)  (3 unrouted)
  Top 0.203: 72.19,44.02 72.14,44.07
  Top 0.254: 72.14,44.07 71.26,44.95 61.72,44.95 57.57,40.8 57.57,37.08 v57.57,27.3 | v58.47,24.1 58.51,24.06 OK1.4 58.51,19.02 67.89,19
  Bottom 0.254: v57.57,27.3 58.47,26.4 v58.47,24.1
D1/TX  (via drill 0.5)  (1 unrouted)
  Top 0.254: v61.37,42.65 63.02,44.3 70.77,44.35 71.54,43.58 U1_TQFP.31 | v47.83,26.7 47.83,24.16 R3.2 v50.06,24
  Bottom 0.254: v61.37,42.65 55.37,36.65 55.37,34.23 55.37,32.77 49.3,26.7 v47.83,26.7 | 65.35,19.05 50.06,19 v50.06,24
D2  (via drill 0.5)
  Top 0.254: RF.IRQ 89.6,32.7 87.57,32.7 86.61,33.66 76.07,33.66 75.18,34.54 v74.51,34.79 | v69.84,42.5 70.59,42.5 U1_TQFP.32
  Bottom 0.203: 74.3,34.8 v74.51,34.79 74.42,34.67 74.42,36.32 69.85,40.9
  Bottom 0.254: v69.84,42.5 69.85,42.12 69.85,40.9
D3
  Top 0.254: U1_TQFP.1 66.29,40.85 I/O.1
D4
  Top 0.203: U1_TQFP.2 71.62,40.33 71.63,40.34
  Top 0.254: U1_TQFP.2 70.84,39.5 68.72,39.5 67.5,38.28 I/O.2
D5/PWM0  (via drill 0.5)  (1 unrouted)
  Top 0.203: 77.01,37.04 U1_TQFP.9
  Top 0.254: v76.07,35.67 77.22,36.75 | R8.2 50.41,40.67 62.18,52.4 77.17,52.4 77.17,53.14 80.65,53.14 v80.65,51.22
  Bottom 0.254: v76.07,35.67 80.47,40.5 v80.65,51.22
D6
  Top 0.254: U1_TQFP.10 78.37,36.79 78.37,36.12 77.84,35.6 R10.2
D7
  Top 0.203: U1_TQFP.11 78.26,38.07 78.21,38.08
D8  (via drill 0.5)
  Top 0.203: U1_TQFP.12 78.83,38.65 78.79,38.63
  Top 0.254: S3.4 v86.11,46.99 | U1_TQFP.12 78.83,38.55 v80.29,37.08
  Bottom 0.203: v86.11,46.99 86.11,38.61 83.69,36.2 81.15,36.2
  Bottom 0.254: v80.29,37.08 81.15,36.22 81.15,36.2
D9  (via drill 0.5)
  Top 0.203: U1_TQFP.13 79.39,39.23 79.38,39.14
  Top 0.254: S3.3 82.91,49.55 v84.89,49.55 | v81.92,37.13 81.41,37.13 U1_TQFP.13
  Bottom 0.254: v81.92,37.13 84.89,40.11 v84.89,49.55
D10
  Top 0.203: 91.77,33.71 R24.1 91.82,34.1 91.82,34.92 91.19,35.56 84.96,35.56 82.17,38.35 81.28,38.35 79.96,39.68 U1_TQFP.14 79.91,39.72 79.93,39.83
  Top 0.254: RF.SEL 93.34,14.22 93.34,33.71 91.77,33.71
D11/MOSI
  Top 0.203: ISP.4 87.95,40.58 89.15,39.37 92.84,39.37 93.73,38.48 | 87.59,13.58 RF.SDI | 80.47,40.36 80.49,40.29 U1_TQFP.15 80.52,40.25 81.66,39.12 82.4,39.12 85.45,36.07 93.9,36.07
  Top 0.254: 87.59,13.58 87.63,13.58 87.63,11.18 93.9,11.18 93.9,36.07 93.9,38.31 93.73,38.48
D12/MISO  (via drill 0.5)
  Top 0.203: RF.SDO 91.6,32.35 v91.57,32.38 | ISP.1 90.49,37.4 89.79,36.7 85.85,36.7 82.55,40.01 81.94,40.01 U1_TQFP.16 81.04,40.93
  Bottom 0.203: v91.57,32.38 91.57,37.02 ISP.1
D13/SCK  (via drill 0.5)
  Top 0.203: RF.SCK 89.6,12.48 v89.66,12.18 | v81.89,42.18 81.11,42.97 U1_TQFP.17 81.04,42.87 | v84.08,42.17 84.2,41.92 84.14,41.92 89.22,41.91 ISP.3
  Top 0.254: ISP.3 92.46,40.64 94.39,38.73 94.41,10.16 v89.66,10.16
  Bottom 0.203: v81.89,42.18 v84.08,42.17 | v89.66,10.16 v89.66,12.18
DIG1
  Top 1.016: RF.ANT 73.14,14.22 C20.1 73.14,9.36 C16.1 73.1,9.4 C19.1
  Top 1.143: C20.1 arc-90 73.07,11.12
GND  (via drill 0.5, 3.2 pad 5.59, 3.2 pad 6.45)  (74 unrouted)
  Top 0.254: 70.34,38.75 71.22,38.75 U1_TQFP.3 | S3.1 S3.2
  Top 0.406: USB.MTN1 USB.MTN2 | S3.1 91.72,46.95 ISP.6
  other vias: 76.07,41.91 55.94,23.87 6.27,61.88 40.92,47.64 80.32,59.41 81.61,48.27 67.97,37.25 68.44,28.46 71.1,54.78 88.26,61.89 84.94,11.33 49.81,68.48 39.37,26.67 84.59,34.77 84.94,38.99 85.28,55.93 6.27,3.87 88.26,3.86 33.89,32.88 46.92,38.54 51.8,25.24 56.96,41.65
  pour Bottom (isolate 0.254): 3.05,70.87 3.05,58.17 0.25,58.17 0.25,7.62 3.05,7.62 3.05,0.25 91.95,0.25 91.95,7.62 95,7.62 95,58.17 91.95,58.17 91.95,70.87
  pour Top (isolate 0.254): 3.05,70.87 3.05,58.17 0.25,58.17 0.25,7.62 3.05,7.62 3.05,0.25 91.95,0.25 91.95,7.62 95,7.62 95,58.17 91.95,58.17 91.95,70.87
GND-ISO  (via drill 0.5)
  other vias: 45.68,10.8 39.14,5.98 38.79,11.11
  pour Top (isolate 0.254): 31.75,14.99 60.2,14.99 60.2,0.25 31.75,0.25
  pour Bottom (isolate 0.254): 31.74,14.98 60.07,15 60.2,0.31 31.75,0.31
IND
  Top 1.016: 43.41,62.85 I1.P$1 | 5V_REG.2 43.66,62.7 I1.P$1 | I1.P$1 43.63,62.57 D2.P$1
INPUTHIGH1  (8 unrouted)
INPUTHIGH2  (3 unrouted)
  Top 0.254: R1.2 21.26,36.85 21.08,36.85
  Top 0.406: JP-LOAD.1 JP-LOAD.2 JP-LOAD.3 JP-LOAD.4 JP-LOAD.5 37.98,28.82 41.36,28.82 LMP8481.1 | 43.22,30.72 LMP8481.1 | C6.1 LMP8481.1 | 16.38,36.83 16.38,36.85 21.08,36.85
  Top 1.016: 14.48,36.83 16.38,36.83
LOADLOW1  (7 unrouted)
LOADLOW2  (via drill 0.5)  (1 unrouted)
  Top 0.406: JP-SOURCE.1 JP-SOURCE.2 JP-SOURCE.3 JP-SOURCE.4 JP-SOURCE.5 41.44,36.85 41.7,36.59 | 43.25,35.09 LMP8481.8 | v46.61,34.8 46.61,33.78 | 41.7,36.59 LMP8481.8 | v42.6,36.95 42.05,36.95 41.7,36.59 | C24.2 LMP8481.8
  Bottom 0.406: v42.6,36.95 46.61,36.96 v46.61,34.8
N$1
  Top 0.203: 74.42,37.43 U1_TQFP.7
  Top 0.254: U1_TQFP.7 74.42,37.46 71.63,34.67 64.39,34.67 Q1.2
  Top 0.406: C4.1 62.23,32.51 Q1.2
N$2  (1 unrouted)
  Top 0.203: U1_TQFP.23 77.69,46.33 77.67,46.33
  Top 0.254: 78.54,50.26 R4.1 78.49,50.42 C5.2 78.52,47.32 77.69,46.4 U1_TQFP.23
N$3  (1 unrouted)
N$4  (1 unrouted)
N$5  (1 unrouted)
N$6
  Top 0.254: LMP8481.5 45.2,37.26 R5.1
N$9
  Top 0.203: 75.09,36.94 U1_TQFP.8
  Top 0.254: Q1.1 72.14,34.01 U1_TQFP.8
  Top 0.406: C11.1 72.35,32.55 Q1.1
N$10
  Top 0.254: C2.1 38.95,7.77 JP-UART.DTR
N$11
  Top 1.016: C16.2 73.1,4.7 ANT1.1
  Top 1.143: 72.85,5.59 arc-90 ANT1.1
N$13
  Top 0.254: OK1.2 55.97,10.5 R7.2
N$15
  Top 0.254: R3.1 45.87,23.88 OK2.2
N$17
  Top 0.254: OK3.2 R6.2
N$20
  Top 0.203: U1_TQFP.20 79.33,44.66 79.35,44.6
  Top 0.254: U1_TQFP.20 80.61,45.88 C8.1
N$22  (1 unrouted)
  Top 0.254: 68.73,48.36 69.34,47.75 72.64,47.75 73.15,47.24 73.57,47.24 U1_TQFP.26
N$23  (1 unrouted)
  Top 0.254: U1_TQFP.25 74.19,47.75 73.41,47.75 71.5,49.66
N$24
  Top 1.016: C19.2 78.32,6.75 78.44,6.75
  Top 1.27: J$1.SIG 78.44,6.75
N$25
  Top 0.406: 77.47,60.45 78.49,60.45
N$27  (1 unrouted)
  Top 0.254: U1_TQFP.24 74.4,49.66
N$28  (2 unrouted)
N$31
  Top 0.406: 27.6,28.9 16.08,28.9
N$41
  Top 0.254: R10.1 79.74,35.02 80.78,35.02 LED1.A
POWERIN  (1 unrouted)
  Top 1.016: 5V_REG.1 40.45,61 C51.1 31.11,57.33 C15.1 14.48,55.45
REFINPUT  (1 unrouted)
  Top 0.254: R8.1 44.56,40.67 44.56,38.61 | LMP8481.7 LMP8481.6 44.56,38.58 44.56,38.61 | C12.1 44.56,38.61
RES  (3 unrouted)
  Top 0.254: FTDI/UART.DTR 62.05,20.5
RESET  (via drill 0.5)  (1 unrouted)
  Top 0.203: U1_TQFP.29 72.81,44.66 72.77,44.7
  Top 0.254: R32.1 83.47,53.91 v83.72,53.75 83.97,53.5 85.22,52.25 92.47,52.25 93.72,51 93.72,46.41 ISP.5 | U1_TQFP.29 71.57,45.85 v66.16,45.85 | v31.53,23.95 27.39,23.95 27.39,6.67 MC32882.P$2 MC32882.P$1 | 56.52,24.95 v56.52,33.12 | 40.89,24.02 v39.55,24.02
  Bottom 0.254: v31.53,23.95 v39.55,24.02 47.86,23.95 56.52,32.6 v56.52,33.12 56.52,36.1 66.27,45.85 v66.16,45.85 63.51,45.85 63.51,53.75 v83.72,53.75
RESET-ISO
  Top 0.254: R6.1 35.97,7.73 C2.2
RX-ISO
  Top 0.254: OK2.4 43.33,10.16 | 43.33,10.16 44.45,10.16 44.45,7.77 JP-UART.RXI | R12.2 41.66,10.16 43.33,10.16
TX-ISO
  Top 0.254: R7.1 47.18,10.5 JP-UART.TXO
(copper drawn outside any net)
  shapes: Top area x3

### Text on the board
tPlace: GND | RST | D11 | VSENSE | D3 | D13 | D4 | 3.3V | D12 | MC32882
bPlace: emonDC | wireless energy monitoring node | Technology that helps us live within ecological limits | Designed in | Designed in North Wales UK by Megni | North Wales | Made in UK | Node: | OpenEnergyMonitor.org | Open-Hardware | Lead free PCB - RoHS components
tNames: D2 | <+60V | 16MHz | +60V | POWER / SELECT | 5V | LOAD | RESET
tSilk: 5V | D9 | 2 / / 1 | D8 | RFM12B / RFM69CW | Rx | Tx | 5V | GND | RST | UART / FTDI | emonDC | v0.3 Dec 2016 by DB | based on emonTx / v3.4 by GH and TL | Wireless Energy / Monitoring Node | RST | Rx | Tx | 5V | GND | ISOLATED UART / FTDI
_tsilk: Designed in | North Wales | Made in UK
_bsilk: SMT V0.6 rev3 | emonTx | wireless energy monitoring node | SMT V0.6 rev3 | emonTx | SMT V0.6 rev3 | emonTx | Technology that helps us live within ecological limits | wireless energy monitoring node | wireless energy monitoring node | Designed in North Wales UK by Glyn Hudson & Trystan Lea | Technology that helps us live within ecological limits | Technology that helps us live within ecological limits | Designed in North Wales UK by Glyn Hudson & Trystan Lea | 165mm ant | 433Mhz | Designed in North Wales UK by Glyn Hudson & Trystan Lea | 165mm ant | 165mm ant | 433Mhz | 433Mhz | 868Mhz | 82mm ant | 82mm ant | 82mm ant | 868Mhz | 868Mhz | 78mm ant | 915Mhz | 78mm ant | 915Mhz | 78mm ant | 915Mhz | 165mm ant | 433Mhz | 82mm ant | 868Mhz | 78mm ant | 915Mhz